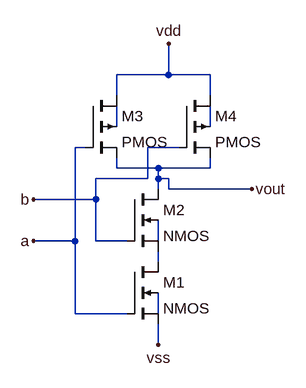
[diagram p0: schematic nand.asc]
nand.asc, the LTspice schematic file:
Version 4.1
SHEET 1 880 680
WIRE 192 -32 192 -80
WIRE 192 -32 112 -32
WIRE 256 -32 192 -32
WIRE 112 0 112 -32
WIRE 256 0 256 -32
WIRE 112 48 112 16
WIRE 256 48 256 16
WIRE 64 80 48 80
WIRE 208 80 160 80
WIRE 112 112 112 96
WIRE 176 112 112 112
WIRE 256 112 256 96
WIRE 256 112 176 112
WIRE 160 128 160 80
WIRE 160 128 80 128
WIRE 176 128 176 112
WIRE 192 128 176 128
WIRE 176 144 176 128
WIRE 192 144 192 128
WIRE 320 144 192 144
WIRE 80 160 80 128
WIRE 80 160 -16 160
WIRE 48 224 48 80
WIRE 48 224 -16 224
WIRE 80 224 80 160
WIRE 128 224 80 224
WIRE 176 224 176 192
WIRE 176 256 176 240
WIRE 48 336 48 224
WIRE 128 336 48 336
WIRE 176 336 176 304
WIRE 176 384 176 352
FLAG -16 224 a
FLAG -16 160 b
FLAG 192 -80 vdd
FLAG 320 144 vout
FLAG 176 384 vss
SYMBOL nmos4 128 256 R0
SYMATTR InstName M1
SYMBOL nmos4 128 144 R0
SYMATTR InstName M2
SYMBOL pmos4 64 0 R0
SYMATTR InstName M3
SYMBOL pmos4 208 0 R0
SYMATTR InstName M4

The netlist it stands for:
* nand.asc
M1 N004 a vss N005 NMOS
M2 vout b N004 N003 NMOS
M3 vdd a vout N001 PMOS
M4 vdd b vout N002 PMOS
.model NMOS NMOS
.model PMOS PMOS
.lib standard.mos
.backanno
.end